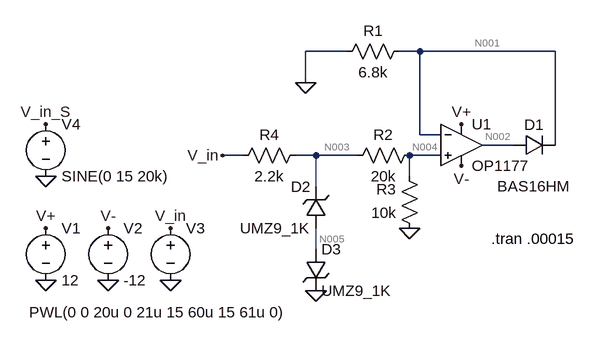
[diagram p0: schematic Half wave attenuator for ADC.asc]
Half wave attenuator for ADC.asc, the LTspice schematic file:
Version 4
SHEET 1 880 680
WIRE 112 -128 48 -128
WIRE 224 -128 192 -128
WIRE 432 -128 224 -128
WIRE 48 -80 48 -128
WIRE 224 0 224 -128
WIRE 256 0 224 0
WIRE 368 16 320 16
WIRE 432 16 432 -128
WIRE -48 32 -80 32
WIRE 64 32 32 32
WIRE 128 32 64 32
WIRE 256 32 208 32
WIRE 208 64 208 32
WIRE 64 80 64 32
WIRE 64 176 64 144
FLAG -352 144 V+
FLAG 288 -16 V+
FLAG -256 144 V-
FLAG 288 48 V-
FLAG -160 224 0
FLAG -256 224 0
FLAG -352 224 0
FLAG 48 -80 0
FLAG -160 144 V_in
FLAG -80 32 V_in
FLAG -352 64 0
FLAG -352 -16 V_in_S
FLAG 208 144 0
FLAG 64 240 0
SYMBOL voltage -352 128 R0
WINDOW 123 0 0 Left 0
WINDOW 39 0 0 Left 0
SYMATTR InstName V1
SYMATTR Value 12
SYMBOL voltage -256 128 R0
WINDOW 123 0 0 Left 0
WINDOW 39 0 0 Left 0
SYMATTR InstName V2
SYMATTR Value -12
SYMBOL voltage -160 128 R0
WINDOW 3 -218 145 Left 2
WINDOW 123 0 0 Left 0
WINDOW 39 0 0 Left 0
SYMATTR InstName V3
SYMATTR Value PWL(0 0 20u 0 21u 15 60u 15 61u 0)
SYMBOL res 208 -144 R90
WINDOW 0 0 56 VBottom 2
WINDOW 3 32 56 VTop 2
SYMATTR InstName R1
SYMATTR Value 6.8k
SYMBOL Opamps\\OP1177 288 -48 R0
SYMATTR InstName U1
SYMBOL voltage -352 -32 R0
WINDOW 123 0 0 Left 0
WINDOW 39 0 0 Left 0
SYMATTR InstName V4
SYMATTR Value SINE(0 15 20k)
SYMBOL diode 368 32 R270
WINDOW 0 32 32 VTop 2
WINDOW 3 -32 31 VBottom 2
SYMATTR InstName D1
SYMATTR Value BAS16HM
SYMBOL res 224 16 R90
WINDOW 0 0 56 VBottom 2
WINDOW 3 32 56 VTop 2
SYMATTR InstName R2
SYMATTR Value 20k
SYMBOL res 224 160 R180
WINDOW 0 36 76 Left 2
WINDOW 3 36 40 Left 2
SYMATTR InstName R3
SYMATTR Value 10k
SYMBOL zener 80 144 R180
WINDOW 0 24 64 Left 2
WINDOW 3 24 0 Left 2
SYMATTR InstName D2
SYMATTR Value UMZ9_1K
SYMATTR Description Diode
SYMATTR Type diode
SYMBOL zener 48 176 R0
SYMATTR InstName D3
SYMATTR Value UMZ9_1K
SYMATTR Description Diode
SYMATTR Type diode
SYMBOL res -64 48 R270
WINDOW 0 32 56 VTop 2
WINDOW 3 0 56 VBottom 2
SYMATTR InstName R4
SYMATTR Value 2.2k
TEXT 334 160 Left 2 !.tran .00015

The netlist it stands for:
* Half wave attenuator for ADC.asc
V1 V+ 0 12
V2 V- 0 -12
V3 V_in 0 PWL(0 0 20u 0 21u 15 60u 15 61u 0)
R1 N001 0 6.8k
XU1 N004 N001 V+ V- N002 OP1177  ; pins In+ In- V+ V- OUT
V4 V_in_S 0 SINE(0 15 20k)
D1 N002 N001 BAS16HM
R2 N004 N003 20k
R3 0 N004 10k
D2 N005 N003 UMZ9_1K
D3 N005 0 UMZ9_1K
R4 V_in N003 2.2k
.model D D
.lib standard.dio
.tran .00015
.lib ADI1.lib
.backanno
.end

* Results of the author's LTspice run, read from the files saved beside the schematic
* Operating Point, zero values left out:
*   V(v+) = 12 V
*   V(v-) = -12 V
*   V(n001) = -24.1 µV
*   V(n004) = 13.79 µV
*   V(n002) = -11.27 V
*   V(n003) = 1.366 µV
*   V(n005) = 683.2 nV
*   I(D1) = -5.544 nA
*   I(R4) = -621.1 pA
*   I(R3) = -1.379 nA
*   I(R2) = 621.1 pA
*   I(R1) = -3.544 nA
*   I(V3) = 621.1 pA
*   I(V2) = 500.1 µA
*   I(V1) = -500.1 µA
*   Ix(u1:1) = -2 nA
*   Ix(u1:2) = -2 nA
*   Ix(u1:3) = 500.1 µA
*   Ix(u1:4) = -500.1 µA
*   Ix(u1:5) = 5.567 nA
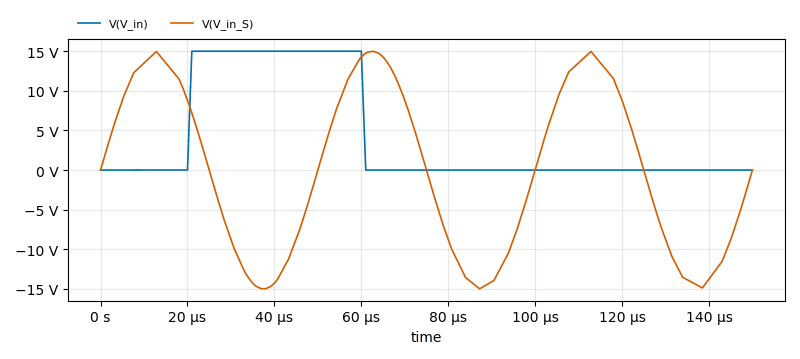
[diagram p1: Transient Analysis of Half wave attenuator for ADC.asc, plotted from the saved traces]
* Transient Analysis, 1 run:
*   V(V_in): min 0 V, max 15 V, average 4 V, rms 7.714 V, last 0 V
*   V(V_in_S): min -14.99 V, max 15 V, average -27.03 mV, rms 10.5 V, last 0 V